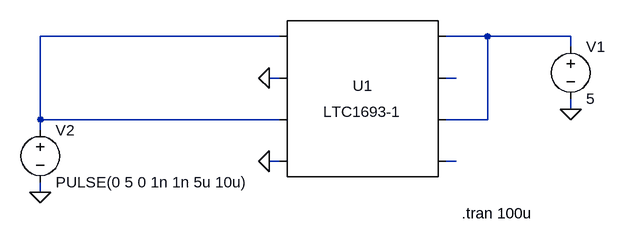
[diagram p0: schematic 1693-1.asc]
1693-1.asc, the LTspice schematic file:
Version 4
SHEET 1 2388 1428
WIRE 1440 1072 1072 1072
WIRE 1760 1072 1696 1072
WIRE 1888 1072 1760 1072
WIRE 1888 1088 1888 1072
WIRE 1440 1136 1424 1136
WIRE 1712 1136 1696 1136
WIRE 1888 1184 1888 1168
WIRE 1072 1200 1072 1072
WIRE 1440 1200 1072 1200
WIRE 1760 1200 1760 1072
WIRE 1760 1200 1696 1200
WIRE 1072 1216 1072 1200
WIRE 1440 1264 1424 1264
WIRE 1712 1264 1696 1264
WIRE 1072 1312 1072 1296
FLAG 1888 1184 0
FLAG 1424 1264 0
FLAG 1424 1136 0
FLAG 1072 1312 0
SYMBOL voltage 1888 1072 R0
SYMATTR InstName V1
SYMATTR Value 5
SYMBOL voltage 1072 1200 R0
WINDOW 123 0 0 Left 2
WINDOW 39 0 0 Left 2
SYMATTR InstName V2
SYMATTR Value PULSE(0 5 0 1n 1n 5u 10u)
SYMBOL PowerProducts\\LTC1693-1 1568 1168 R0
SYMATTR InstName U1
TEXT 1720 1344 Left 2 !.tran 100u

The netlist it stands for:
* 1693-1.asc
V1 N002 0 5
V2 N001 0 PULSE(0 5 0 1n 1n 5u 10u)
XU1 N001 0 N001 0 N004 N002 N003 N002 LTC1693-1
.tran 100u
.lib LTC1693-1.sub
.backanno
.end